# Altium schematic sheet Single cell module.SchDoc
size A4; SheetNumber: 1; SheetTotal: 2
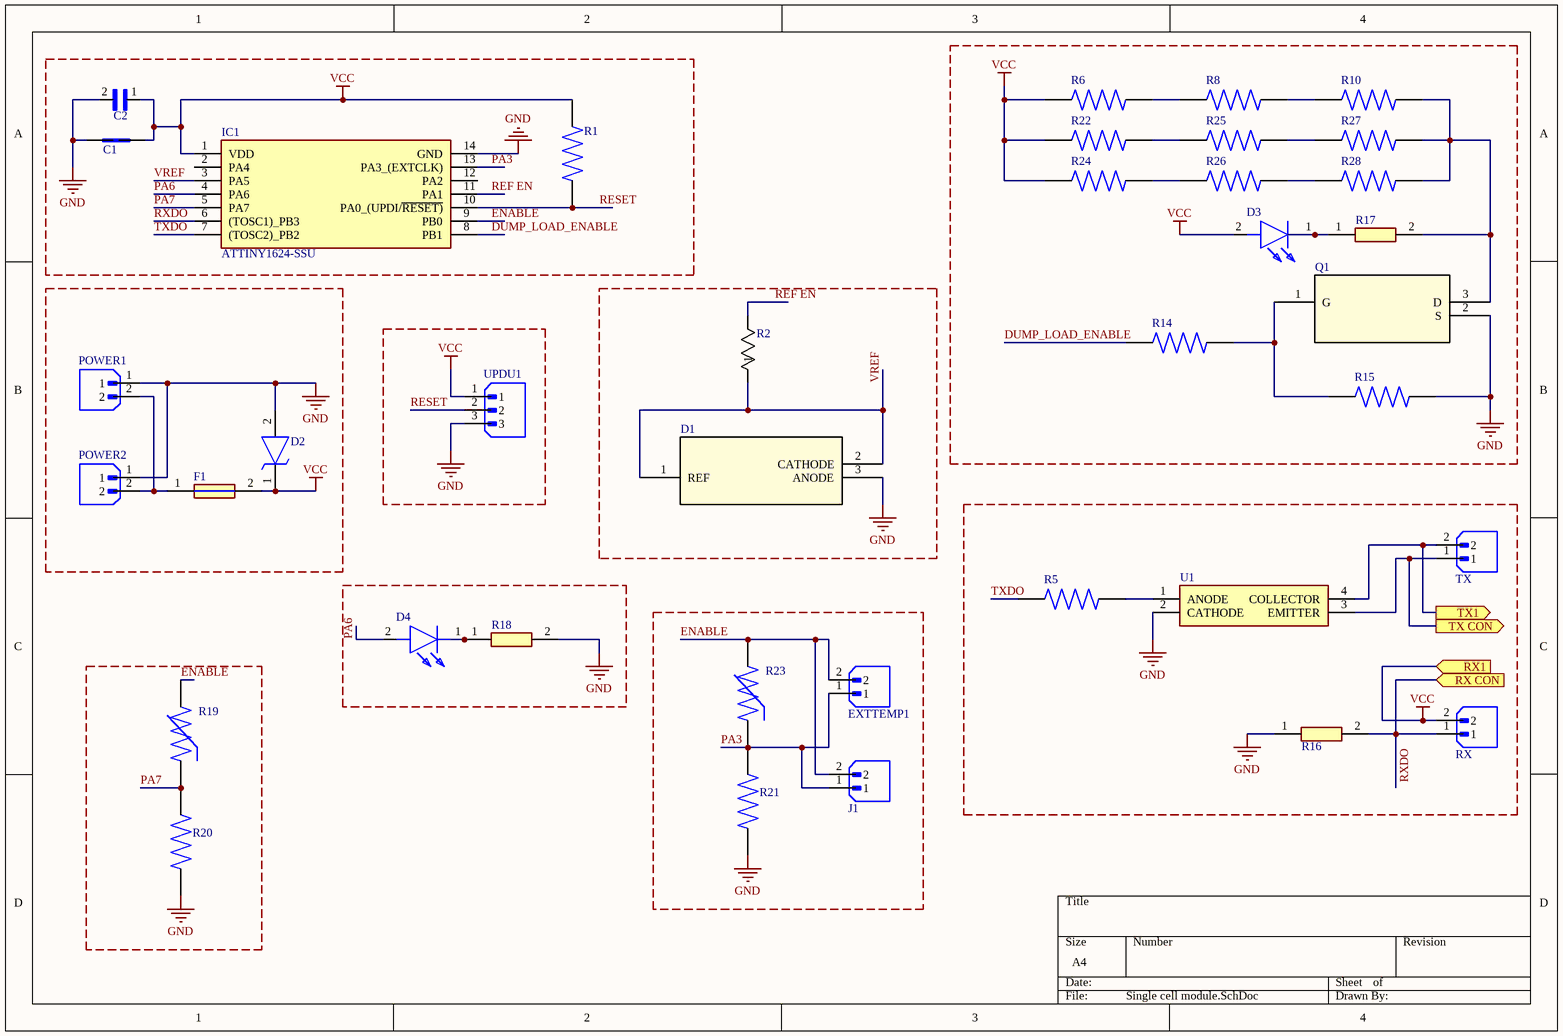
[diagram p0: Single cell module.SchDoc]

## Parts
C1  CC0805KRX7R9BB104  [CAPC2012X70]  (value not drawn)
C2  CL21A106KAYNNNE  [CAPC2012X135N]  (value not drawn)
D1  AZ432ANTR-E1  [SOT-23_DIO]  (value not drawn)
D2  SM6T6V8A  [DIOM5436X265N]  (value not drawn)
D3  19-217_GHC-YR1S2_3T  [LEDC1608X50N]  (value not drawn)
D4  19-217_GHC-YR1S2_3T  [LEDC1608X50N]  (value not drawn)
EXTTEMP1  B2B-XH-A(LF)(SN)  [JST_B2B-XH-A(LF)(SN)]  (value not drawn)
F1  MF-MSMF150-2  [FUSC4632X85N]  (value not drawn)
IC1  ATTINY1624-SSU  [SOIC127P600X175-14N]
J1  B2B-XH-A(LF)(SN)  [JST_B2B-XH-A(LF)(SN)]  (value not drawn)
POWER1  B2B-XH-A(LF)(SN)  [JST_B2B-XH-A(LF)(SN)]  (value not drawn)
POWER2  B2B-XH-A(LF)(SN)  [JST_B2B-XH-A(LF)(SN)]  (value not drawn)
Q1  AO3400A  [SOT-23-3L_AOS]  (value not drawn)
R1  ERA6ARW104V  [RES_ERA6ARW104V]  (value not drawn)
R2  0805W8F1001T5E  [RES_8F1001T5E_UNR]  (value not drawn)
R5  ERJ6ENF1800V  [RES_ERJ6ENF1800V]  (value not drawn)
R6  ERA6ARW104V  [RES_ERA6ARW104V]  (value not drawn)
R8  ERA6ARW104V  [RES_ERA6ARW104V]  (value not drawn)
R10  ERA6ARW104V  [RES_ERA6ARW104V]  (value not drawn)
R14  RT1206DRD07510RL  [RESC3116X65N]  (value not drawn)
R15  ERJP06D1002V  [RES_ERJP06D1002V]  (value not drawn)
R16  0805W8F2201T5E  [RESC2013X65N]  (value not drawn)
R17  0805W8F2201T5E  [RESC2013X65N]  (value not drawn)
R18  0805W8F2201T5E  [RESC2013X65N]  (value not drawn)
R19  NCP18WF104J03RB  [THRMC1608X95N]  (value not drawn)
R20  ERJP06D1002V  [RES_ERJP06D1002V]  (value not drawn)
R21  ERJP06D1002V  [RES_ERJP06D1002V]  (value not drawn)
R22  ERA6ARW104V  [RES_ERA6ARW104V]  (value not drawn)
R23  NCP18WF104J03RB  [THRMC1608X95N]  (value not drawn)
R24  ERA6ARW104V  [RES_ERA6ARW104V]  (value not drawn)
R25  ERA6ARW104V  [RES_ERA6ARW104V]  (value not drawn)
R26  ERA6ARW104V  [RES_ERA6ARW104V]  (value not drawn)
R27  ERA6ARW104V  [RES_ERA6ARW104V]  (value not drawn)
R28  ERA6ARW104V  [RES_ERA6ARW104V]  (value not drawn)
RX  B2B-XH-A(LF)(SN)  [JST_B2B-XH-A(LF)(SN)]  (value not drawn)
TX  B2B-XH-A(LF)(SN)  [JST_B2B-XH-A(LF)(SN)]  (value not drawn)
U1  EL3H7_B__TA_-G  [SOIC127P700X200-4N]  (value not drawn)
UPDU1  B3B-XH-A_(LF)(SN)  [JST_B3B-XH-A (LF)(SN)]  (value not drawn)

## Ports
RX1 (in), RX CON (in), TX1 (out), TX CON (out)

## Nets
GND: C1.1 C2.2 D1.3(ANODE) D2.2(A) IC1.14(GND) POWER1.1 POWER2.1 Q1.2(S) R15.2 R16.1 R18.2 R20.1 R21.1 U1.2(CATHODE) UPDU1.3
VCC: C1.2 C2.1 D2.1(K) D3.2(A) F1.2 IC1.1(VDD) R1.2 R6.1 R22.1 R24.1 RX.2 UPDU1.1 ; port RX1
DUMP_LOAD_ENABLE: IC1.8(PB1) R14.1
ENABLE: EXTTEMP1.2 IC1.9(PB0) J1.2 R19.2 R23.2
PA3: EXTTEMP1.1 IC1.13(PA3_(EXTCLK)) J1.1 R21.2 R23.1
PA6: D4.2(A) IC1.4(PA6)
PA7: IC1.5(PA7) R19.1 R20.2
REF EN: IC1.11(PA1) R2.2
RESET: IC1.10(PA0_(UPDI/~{RESET)}) R1.1 UPDU1.2
RXDO: IC1.6((TOSC1)_PB3) R16.2 RX.1 ; port RX CON
TX1: TX.2 U1.4(COLLECTOR) ; port TX1
TX CON: TX.1 U1.3(EMITTER) ; port TX CON
TXDO: IC1.7((TOSC2)_PB2) R5.1
VREF: D1.1(REF) D1.2(CATHODE) IC1.3(PA5) R2.1
NetD3_1: D3.1(K) R17.1
NetD4_1: D4.1(K) R18.1
NetF1_1: F1.1 POWER1.2 POWER2.2
NetQ1_1: Q1.1(G) R14.2 R15.1
NetQ1_3: Q1.3(D) R10.2 R17.2 R27.2 R28.2
NetR5_2: R5.2 U1.1(ANODE)
NetR6_2: R6.2 R8.1
NetR8_2: R8.2 R10.1
NetR22_2: R22.2 R25.1
NetR24_2: R24.2 R26.1
NetR25_2: R25.2 R27.1
NetR26_2: R26.2 R28.1

Not connected (* = marked no-connect by the designer): IC1 2(PA4) 12(PA2)

## Library data of the parts
C1 = CC0805KRX7R9BB104: 0.1ÂµF Â±10% 50V Ceramic Capacitor X7R 0805 _2012 Metric_; MF: Yageo; Value: *; Availability: Unavailable; SnapEDA_Link: https://www.snapeda.com/parts/CC0805KRX7R9BB104/Yageo/view-part/105548/?ref=snap; Package: 0805 Yageo; MP: CC0805KRX7R9BB104; Price: None
C2 = CL21A106KAYNNNE: 10ÂµF Â±10% 25V Ceramic Capacitor X5R 0805 (2012 Metric); MF: Samsung; Value: *; Check_prices: https://www.snapeda.com/parts/CL21A106KAYNNNE/Samsung/view-part/3598482/?ref=eda; Package: 0805 Samsung; SnapEDA_Link: https://www.snapeda.com/parts/CL21A106KAYNNNE/Samsung/view-part/3598482/?ref=snap; MP: CL21A106KAYNNNE; Digi-Key_Part_Number: 1276-2891-1-ND
D1 = AZ432ANTR-E1: No Description Available; Mfr_Name: Diodes Inc; RefDes: RefDes; Type: Type
D2 = SM6T6V8A: TVS Diode (Uni-directional); Manufacturer_Name: STMicroelectronics; Datasheet Link: https://www.st.com/resource/en/datasheet/sm6t100a.pdf; Height: 2.65mm; Manufacturer_Part_Number: SM6T6V8A; Mouser Part Number: 511-SM6T6V8A; Mouser Price/Stock: https://www.mouser.co.uk/ProductDetail/STMicroelectronics/SM6T6V8A?qs=gFQxgRPje42DFJYRsrsouA%3D%3D; Arrow Part Number: SM6T6V8A; Arrow Price/Stock: https://www.arrow.com/en/products/sm6t6v8a/stmicroelectronics?region=nac
D3 D4 = 19-217_GHC-YR1S2_3T: LED; Manufacturer_Name: Everlight; Manufacturer_Part_Number: 19-217/GHC-YR1S2/3T; Datasheet Link: https://www.mouser.co.uk/datasheet/2/143/19-217-GHC-YR1S2-3T-1663276.pdf; Height: 0.5mm; Mouser Part Number: 638-19217GHCYR1S23T; Mouser Price/Stock: https://www.mouser.co.uk/ProductDetail/Everlight/19-217-GHC-YR1S2-3T?qs=8cKuZ6Ok2lZjmFTUzVFjDg%3D%3D; Arrow Part Number: 19-217/GHC-YR1S2/3T; Arrow Price/Stock: https://www.arrow.com/en/products/19-217ghc-yr1s23t/everlight-electronics
EXTTEMP1 J1 POWER1 POWER2 RX TX = B2B-XH-A(LF)(SN): Connector Header Through Hole 2 position 0.098 (2.50mm); MF: JST Sales America Inc.; SnapEDA_Link: https://www.snapeda.com/parts/B2B-XH-A(LF)(SN)/JST+Sales+America+Inc./view-part/?ref=snap; Package: None; Value: *; MP: B2B-XH-A(LF)(SN); Check_prices: https://www.snapeda.com/parts/B2B-XH-A(LF)(SN)/JST+Sales+America+Inc./view-part/?ref=eda
F1 = MF-MSMF150-2: Fuse; Manufacturer_Name: Bourns; Datasheet Link: https://componentsearchengine.com/Datasheets/2/MF-MSMF150-2.pdf; Height: 0.85mm; Manufacturer_Part_Number: MF-MSMF150-2; Mouser Part Number: 652-MF-MSMF150-2; Mouser Price/Stock: https://www.mouser.co.uk/ProductDetail/Bourns/MF-MSMF150-2?qs=VJkZAnU6DY2RTCSZT8Bxqg%3D%3D; Arrow Part Number: MF-MSMF150-2; Arrow Price/Stock: https://www.arrow.com/en/products/mf-msmf150-2/bourns?region=nac
IC1 = ATTINY1624-SSU: Integrated Circuit; Manufacturer_Name: Microchip; Datasheet Link: https://ww1.microchip.com/downloads/en/DeviceDoc/ATtiny1624-26-27-DataSheet-DS40002234A.pdf; Height: 1.75mm; Manufacturer_Part_Number: ATTINY1624-SSU; Mouser Part Number: 556-ATTINY1624-SSU; Mouser Price/Stock: https://www.mouser.co.uk/ProductDetail/Microchip-Technology/ATTINY1624-SSU?qs=vmHwEFxEFR%2FHKYGUmUC%2Fzw%3D%3D; Arrow Part Number: ATTINY1624-SSU; Arrow Price/Stock: https://www.arrow.com/en/products/attiny1624-ssu/microchip-technology?region=nac
Q1 = AO3400A: No Description Available; Mfr_Name: Alpha and Omega Semiconductor; RefDes: RefDes; Type: Type
R2 = 0805W8F1001T5E: No Description Available; Mfr_Name: Uniroyal
R14 = RT1206DRD07510RL: RES SMD 510 OHM 0.5% 1/8W 1206; Package: None; Price: None; Value: *; MP: RT1206DRD07510RL; Availability: Unavailable
R16-R18 = 0805W8F2201T5E: Resistor; Manufacturer_Name: ROYALOHM; Datasheet Link: https://www.mouser.fr/datasheet/2/1365/GeneralPurpose-2498088.pdf; Height: 0.65mm; Manufacturer_Part_Number: 0805W8F2201T5E; Mouser Part Number: 303-0805W8F2201T5E; Mouser Price/Stock: https://www.mouser.co.uk/ProductDetail/Royalohm/0805W8F2201T5E?qs=e8oIoAS2J1RJNRSZp0Nryw%3D%3D
R19 R23 = NCP18WF104J03RB: NTC Thermistor 100k 0603 (1608 Metric); MF: Murata Electronics; Package: 1608 Murata; Check_prices: https://www.snapeda.com/parts/NCP18WF104J03RB/Murata%20Electronics%20North%20America/view-part/144301/?ref=eda; Value: *; Purchase-URL: https://pricing.snapeda.com/search/part/NCP18WF104J03RB/?ref=eda; SnapEDA_Link: https://www.snapeda.com/parts/NCP18WF104J03RB/Murata%20Electronics%20North%20America/view-part/144301/?ref=snap; Availability: Good; MP: NCP18WF104J03RB; Price: None
U1 = EL3H7_B__TA_-G: Integrated Circuit; Manufacturer_Name: Everlight; Manufacturer_Part_Number: EL3H7(B)(TA)-G; Datasheet Link: https://www.arrow.com/en/products/el3h7-b-ta-g/everlight-electronics?region=nac; Height: 2mm; Mouser Part Number: 638-EL3H7BTAG; Mouser Price/Stock: https://www.mouser.co.uk/ProductDetail/Everlight/EL3H7BTA-G?qs=8PzhAHr7IdM%252B0XGOXhFFCg%3D%3D; Arrow Part Number: EL3H7(B)(TA)-G; Arrow Price/Stock: https://www.arrow.com/en/products/el3h7-b-ta-g/everlight-electronics?region=nac
UPDU1 = B3B-XH-A_(LF)(SN): Connector Header Through Hole 3 position 0.098 (2.50mm); MF: JST Sales America Inc.; MP: B3B-XH-A (LF)(SN); SnapEDA_Link: https://www.snapeda.com/parts/B3B-XH-A%20(LF)(SN)/JST+Sales+America+Inc./view-part/?ref=snap; Package: None; Value: *; Check_prices: https://www.snapeda.com/parts/B3B-XH-A%20(LF)(SN)/JST+Sales+America+Inc./view-part/?ref=eda
R1 R6 R8 R10 R22 R24-R28 = ERA6ARW104V: Value: *; Package: None; MP: ERA6ARW104V; Availability: Unavailable; Price: None
R5 = ERJ6ENF1800V: Value: *; Availability: Unavailable; Price: None; MP: ERJ6ENF1800V; Package: None
R15 R20 R21 = ERJP06D1002V: Price: None; Value: *; MP: ERJP06D1002V; Package: None; Availability: Unavailable